# Altium schematic sheet BLUESAT WIRING HARNESS - PROPOSED V2.SchDoc: Tray Interconnect Diagram
size A3; Engineer: D. JEDRYCHOWSKI; Organization: BLUEsat Project; Address1: Room 419; Address2: School of EE&T; Address3: UNSW, NSW 2052; Address4: Australia; DocumentNumber: TITL0001; Description: Tray Interconnections for 2013 Launch; Version: 1.0
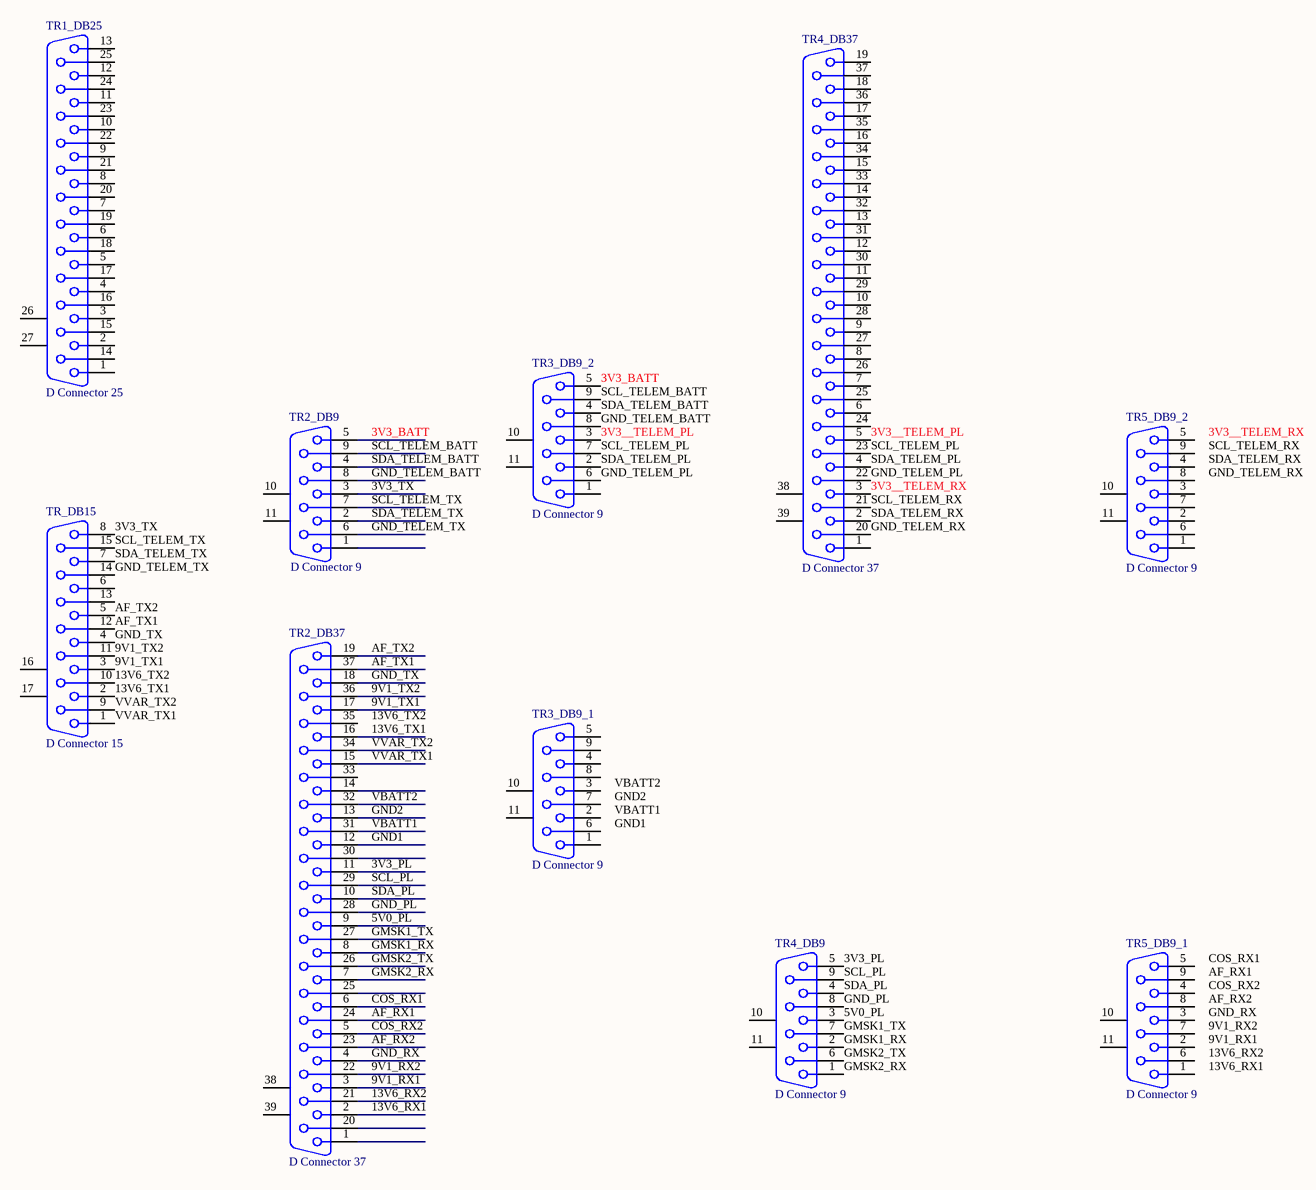
[diagram p0: BLUESAT WIRING HARNESS - PROPOSED V2.SchDoc]

## Parts
TR1_DB25  D Connector 25  [DSUB1.385-2H25A]
TR2_DB9  D Connector 9  [DSUB1.385-2H9]
TR2_DB37  D Connector 37
TR3_DB9_1  D Connector 9  [DSUB1.385-2H9]
TR3_DB9_2  D Connector 9  [DSUB1.385-2H9]
TR4_DB9  D Connector 9  [DSUB1.385-2H9]
TR4_DB37  D Connector 37
TR5_DB9_1  D Connector 9  [DSUB1.385-2H9]
TR5_DB9_2  D Connector 9  [DSUB1.385-2H9]
TR_DB15  D Connector 15  [DSUB1.385-2H15]

## Nets
3V3__TELEM_PL: TR3_DB9_2.3 TR4_DB37.5
3V3__TELEM_RX: TR4_DB37.3
3V3_BATT: TR2_DB9.5 TR3_DB9_2.5
3V3_PL: TR2_DB37.11 TR4_DB9.5
3V3_TX: TR2_DB9.3 TR_DB15.8
5V0_PL: TR2_DB37.9 TR4_DB9.3
9V1_RX1: TR2_DB37.3
9V1_RX2: TR2_DB37.22
9V1_TX1: TR2_DB37.17 TR_DB15.3
9V1_TX2: TR2_DB37.36 TR_DB15.11
13V6_RX1: TR2_DB37.2
13V6_RX2: TR2_DB37.21
13V6_TX1: TR2_DB37.16 TR_DB15.2
13V6_TX2: TR_DB15.10
AF_RX1: TR2_DB37.24
AF_RX2: TR2_DB37.23
AF_TX1: TR2_DB37.37 TR_DB15.12
AF_TX2: TR2_DB37.19 TR_DB15.5
COS_RX1: TR2_DB37.6
COS_RX2: TR2_DB37.5
GMSK1_RX: TR2_DB37.8 TR4_DB9.2
GMSK1_TX: TR2_DB37.27 TR4_DB9.7
GMSK2_RX: TR2_DB37.7 TR4_DB9.1
GMSK2_TX: TR2_DB37.26 TR4_DB9.6
GND1: TR2_DB37.12
GND2: TR2_DB37.13
GND_PL: TR2_DB37.28 TR4_DB9.8
GND_RX: TR2_DB37.4
GND_TELEM_BATT: TR2_DB9.8 TR3_DB9_2.8
GND_TELEM_PL: TR3_DB9_2.6 TR4_DB37.22
GND_TELEM_RX: TR4_DB37.20
GND_TELEM_TX: TR2_DB9.6 TR_DB15.14
GND_TX: TR2_DB37.18 TR_DB15.4
SCL_PL: TR2_DB37.29 TR4_DB9.9
SCL_TELEM_BATT: TR2_DB9.9 TR3_DB9_2.9
SCL_TELEM_PL: TR3_DB9_2.7 TR4_DB37.23
SCL_TELEM_RX: TR4_DB37.21
SCL_TELEM_TX: TR2_DB9.7 TR_DB15.15
SDA_PL: TR2_DB37.10 TR4_DB9.4
SDA_TELEM_BATT: TR2_DB9.4 TR3_DB9_2.4
SDA_TELEM_PL: TR3_DB9_2.2 TR4_DB37.4
SDA_TELEM_RX: TR4_DB37.2
SDA_TELEM_TX: TR2_DB9.2 TR_DB15.7
VBATT1: TR2_DB37.31
VBATT2: TR2_DB37.32
VVAR_TX1: TR2_DB37.15 TR_DB15.1
VVAR_TX2: TR2_DB37.34 TR_DB15.9

Not connected (* = marked no-connect by the designer): TR1_DB25 1 2 3 4 5 6 7 8 9 10 11 12 13 14 15 16 17 18 19 20 21 22 23 24 25 26(MH1) 27(MH2); TR2_DB9 1 10(MH1) 11(MH2); TR2_DB37 1 14 20 25 30 33 35 38(MH1) 39(MH2); TR3_DB9_1 1 2 3 4 5 6 7 8 9 10(MH1) 11(MH2); TR3_DB9_2 1 10(MH1) 11(MH2); TR4_DB9 10(MH1) 11(MH2); TR4_DB37 1 6 7 8 9 10 11 12 13 14 15 16 17 18 19 24 25 26 27 28 29 30 31 32 33 34 35 36 37 38(MH1) 39(MH2); TR5_DB9_1 1 2 3 4 5 6 7 8 9 10(MH1) 11(MH2); TR5_DB9_2 1 2 3 4 5 6 7 8 9 10(MH1) 11(MH2); TR_DB15 6 13 16(MH1) 17(MH2)

## Notes on the sheet
- Labels drawn without touching a wire or pin: 3V3__TELEM_RX, 9V1_RX1, 9V1_RX2, 13V6_RX1, 13V6_RX2, 13V6_TX2, AF_RX1, AF_RX2, COS_RX1, COS_RX2, GND1, GND2, GND_RX, GND_TELEM_RX, SCL_TELEM_RX, SDA_TELEM_RX, VBATT1, VBATT2
- Title
- Description:
- Size:
- Author:
- Date:
- A3
- Time:
- Version
- Sheet:
- Drawing No.:
- of
- File:

## Library data of the parts
TR1_DB25 = D Connector 25: Receptacle Assembly, 25 Position, Right Angle; PackageDocument: U; Positions: 25; Published: 15-Jun-2001; LatestRevisionDate: 17-Jul-2002; LatestRevisionNote: Re-released for DXP Platform.; DatasheetDocument: 19-Mar-1999; PackageReference: 787202; Publisher: Altium Limited; Orientation: Right Angle; Gender: Receptacle
TR2_DB9 TR3_DB9_1 TR3_DB9_2 TR4_DB9 TR5_DB9_1 TR5_DB9_2 = D Connector 9: Receptacle Assembly, 9 Position, Right Angle; PackageDocument: O; Positions: 9; Published: 15-Jun-2001; LatestRevisionDate: 17-Jul-2002; LatestRevisionNote: Re-released for DXP Platform.; DatasheetDocument: 1-Sep-1999; PackageReference: 788750; Publisher: Altium Limited; Orientation: Right Angle; Gender: Receptacle
TR2_DB37 TR4_DB37 = D Connector 37: Receptacle Assembly, 37 Position, Right Angle; PackageDocument: U; Positions: 25; Published: 15-Jun-2001; LatestRevisionDate: 17-Jul-2002; LatestRevisionNote: Re-released for DXP Platform.; DatasheetDocument: 19-Mar-1999; PackageReference: 787202; Publisher: Altium Limited; Orientation: Right Angle; Gender: Receptacle
TR_DB15 = D Connector 15: Receptacle Assembly, 15 Position, Right Angle; PackageDocument: O; Positions: 15; Published: 15-Jun-2001; LatestRevisionDate: 17-Jul-2002; LatestRevisionNote: Re-released for DXP Platform.; DatasheetDocument: 1-Sep-99; PackageReference: 788757; Publisher: Altium Limited; Orientation: Right Angle; Gender: Receptacle